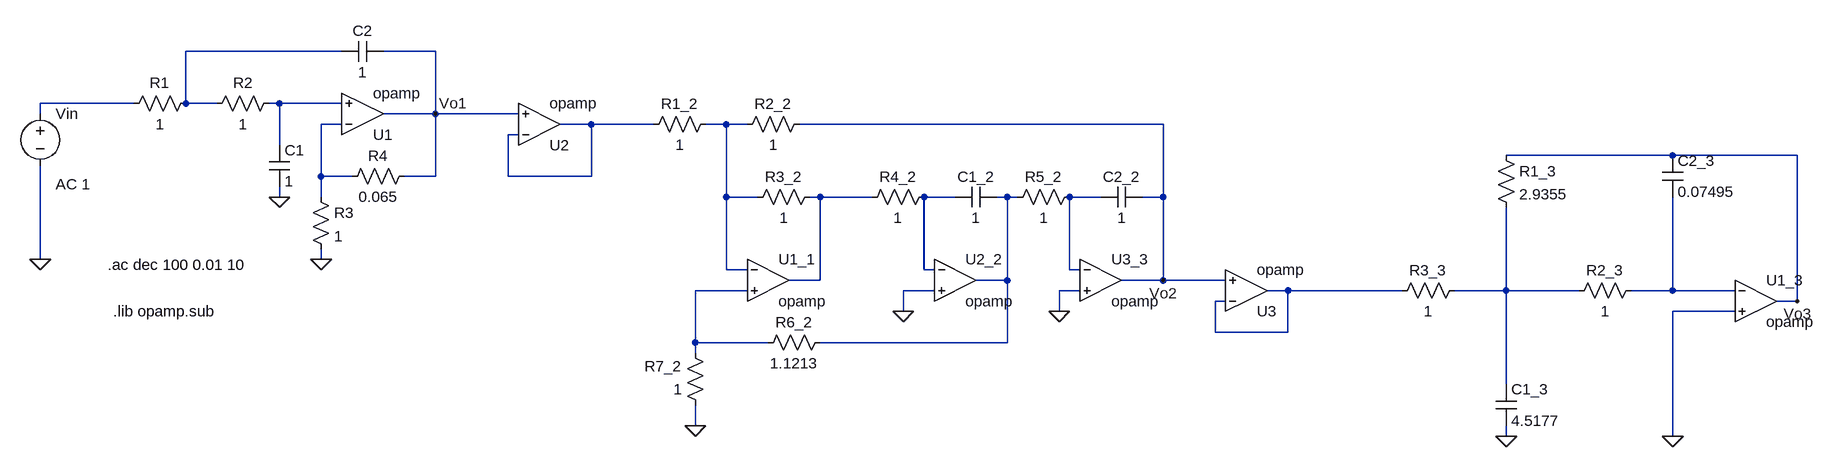
[diagram p0: schematic Tarea_2_Filtro_Completo.asc]
Tarea_2_Filtro_Completo.asc, the LTspice schematic file:
Version 4
SHEET 1 2680 680
WIRE 400 48 160 48
WIRE 544 48 464 48
WIRE 80 128 -64 128
WIRE 160 128 160 48
WIRE 208 128 160 128
WIRE 304 128 288 128
WIRE 400 128 304 128
WIRE -64 144 -64 128
WIRE 544 144 544 48
WIRE 544 144 464 144
WIRE 672 144 544 144
WIRE 400 160 368 160
WIRE 784 160 736 160
WIRE 880 160 784 160
WIRE 992 160 960 160
WIRE 1024 160 992 160
WIRE 1664 160 1104 160
WIRE 672 176 656 176
WIRE 304 192 304 128
WIRE 2448 208 2192 208
WIRE 2640 208 2448 208
WIRE 368 240 368 160
WIRE 416 240 368 240
WIRE 544 240 544 144
WIRE 544 240 496 240
WIRE 656 240 656 176
WIRE 784 240 784 160
WIRE 784 240 656 240
WIRE 304 272 304 256
WIRE 368 272 368 240
WIRE 992 272 992 160
WIRE 1040 272 992 272
WIRE 1136 272 1120 272
WIRE 1216 272 1136 272
WIRE 1344 272 1296 272
WIRE 1424 272 1408 272
WIRE 1440 272 1424 272
WIRE 1568 272 1520 272
WIRE 1664 272 1664 160
WIRE 1664 272 1632 272
WIRE -64 368 -64 224
WIRE 368 368 368 352
WIRE 992 384 992 272
WIRE 1024 384 992 384
WIRE 1296 384 1296 272
WIRE 1312 384 1296 384
WIRE 1520 384 1520 272
WIRE 1536 384 1520 384
WIRE 1136 400 1136 272
WIRE 1136 400 1088 400
WIRE 1424 400 1424 272
WIRE 1424 400 1376 400
WIRE 1664 400 1664 272
WIRE 1664 400 1600 400
WIRE 1760 400 1664 400
WIRE 1024 416 944 416
WIRE 1312 416 1264 416
WIRE 1536 416 1504 416
WIRE 1856 416 1824 416
WIRE 2032 416 1856 416
WIRE 2192 416 2192 288
WIRE 2192 416 2112 416
WIRE 2304 416 2192 416
WIRE 2448 416 2448 272
WIRE 2448 416 2384 416
WIRE 2544 416 2448 416
WIRE 1760 432 1744 432
WIRE 2640 432 2640 208
WIRE 2640 432 2608 432
WIRE 1264 448 1264 416
WIRE 1504 448 1504 416
WIRE 2544 448 2448 448
WIRE 1744 480 1744 432
WIRE 1856 480 1856 416
WIRE 1856 480 1744 480
WIRE 944 496 944 416
WIRE 1056 496 944 496
WIRE 1424 496 1424 400
WIRE 1424 496 1136 496
WIRE 944 512 944 496
WIRE 2192 560 2192 416
WIRE 944 624 944 592
WIRE 2192 640 2192 624
WIRE 2448 640 2448 448
FLAG -64 368 0
FLAG 368 368 0
FLAG 304 272 0
FLAG 544 144 Vo1
FLAG 944 624 0
FLAG 1264 448 0
FLAG 1504 448 0
FLAG 1664 400 Vo2
FLAG 2192 640 0
FLAG 2448 640 0
FLAG 2640 432 Vo3
SYMBOL res 176 112 R90
WINDOW 0 0 56 VBottom 2
WINDOW 3 32 56 VTop 2
SYMATTR InstName R1
SYMATTR Value 1
SYMBOL voltage -64 128 R0
WINDOW 123 24 124 Left 2
WINDOW 39 0 0 Left 0
SYMATTR Value2 AC 1
SYMATTR InstName Vin
SYMATTR Value ""
SYMBOL OpAmps\\opamp 432 208 M180
SYMATTR InstName U1
SYMBOL res 304 112 R90
WINDOW 0 0 56 VBottom 2
WINDOW 3 32 56 VTop 2
SYMATTR InstName R2
SYMATTR Value 1
SYMBOL cap 288 192 R0
SYMATTR InstName C1
SYMATTR Value 1
SYMBOL cap 464 32 R90
WINDOW 0 0 32 VBottom 2
WINDOW 3 32 32 VTop 2
SYMATTR InstName C2
SYMATTR Value 1
SYMBOL res 352 256 R0
SYMATTR InstName R3
SYMATTR Value 1
SYMBOL res 512 224 R90
WINDOW 0 0 56 VBottom 2
WINDOW 3 32 56 VTop 2
SYMATTR InstName R4
SYMATTR Value 0.065
SYMBOL OpAmps\\opamp 704 224 M180
SYMATTR InstName U2
SYMBOL res 976 144 R90
WINDOW 0 0 56 VBottom 2
WINDOW 3 32 56 VTop 2
SYMATTR InstName R1_2
SYMATTR Value 1
SYMBOL res 1120 144 R90
WINDOW 0 0 56 VBottom 2
WINDOW 3 32 56 VTop 2
SYMATTR InstName R2_2
SYMATTR Value 1
SYMBOL res 1136 256 R90
WINDOW 0 0 56 VBottom 2
WINDOW 3 32 56 VTop 2
SYMATTR InstName R3_2
SYMATTR Value 1
SYMBOL res 1312 256 R90
WINDOW 0 0 56 VBottom 2
WINDOW 3 32 56 VTop 2
SYMATTR InstName R4_2
SYMATTR Value 1
SYMBOL res 1536 256 R90
WINDOW 0 0 56 VBottom 2
WINDOW 3 32 56 VTop 2
SYMATTR InstName R5_2
SYMATTR Value 1
SYMBOL res 960 608 R180
WINDOW 0 36 76 Left 2
WINDOW 3 36 40 Left 2
SYMATTR InstName R7_2
SYMATTR Value 1
SYMBOL res 1040 512 R270
WINDOW 0 32 56 VTop 2
WINDOW 3 0 56 VBottom 2
SYMATTR InstName R6_2
SYMATTR Value 1.1213
SYMBOL cap 1408 256 R90
WINDOW 0 0 32 VBottom 2
WINDOW 3 32 32 VTop 2
SYMATTR InstName C1_2
SYMATTR Value 1
SYMBOL OpAmps\\opamp 1056 336 R0
SYMATTR InstName U1_1
SYMBOL OpAmps\\opamp 1344 336 R0
SYMATTR InstName U2_2
SYMBOL OpAmps\\opamp 1568 336 R0
SYMATTR InstName U3_3
SYMBOL cap 1632 256 R90
WINDOW 0 0 32 VBottom 2
WINDOW 3 32 32 VTop 2
SYMATTR InstName C2_2
SYMATTR Value 1
SYMBOL OpAmps\\opamp 1792 480 M180
SYMATTR InstName U3
SYMBOL res 2128 400 R90
WINDOW 0 0 56 VBottom 2
WINDOW 3 32 56 VTop 2
SYMATTR InstName R3_3
SYMATTR Value 1
SYMBOL res 2176 192 R0
SYMATTR InstName R1_3
SYMATTR Value 2.9355
SYMBOL res 2400 400 R90
WINDOW 0 0 56 VBottom 2
WINDOW 3 32 56 VTop 2
SYMATTR InstName R2_3
SYMATTR Value 1
SYMBOL cap 2432 208 R0
SYMATTR InstName C2_3
SYMATTR Value 0.07495
SYMBOL cap 2176 560 R0
SYMATTR InstName C1_3
SYMATTR Value 4.5177
SYMBOL OpAmps\\opamp 2576 368 R0
SYMATTR InstName U1_3
TEXT 40 376 Left 2 !.ac dec 100 0.01 10
TEXT 48 448 Left 2 !.lib opamp.sub

The netlist it stands for:
* Tarea_2_Filtro_Completo.asc
R1 N001 N002 1
Vin N002 0 AC 1
XU1 N004 N003 Vo1 opamp Aol=100K GBW=10Meg  ; pins invin noninvin out
R2 N003 N001 1
C1 N003 0 1
C2 Vo1 N001 1
R3 N004 0 1
R4 Vo1 N004 0.065
XU2 N005 Vo1 N005 opamp Aol=100K GBW=10Meg  ; pins invin noninvin out
R1_2 N006 N005 1
R2_2 Vo2 N006 1
R3_2 N007 N006 1
R4_2 N008 N007 1
R5_2 N010 N009 1
R7_2 0 N011 1
R6_2 N011 N009 1.1213
C1_2 N009 N008 1
XU1_1 N006 N011 N007 opamp Aol=100K GBW=10Meg  ; pins invin noninvin out
XU2_2 N008 0 N009 opamp Aol=100K GBW=10Meg  ; pins invin noninvin out
XU3_3 N010 0 Vo2 opamp Aol=100K GBW=10Meg  ; pins invin noninvin out
C2_2 Vo2 N010 1
XU3 N012 Vo2 N012 opamp Aol=100K GBW=10Meg  ; pins invin noninvin out
R3_3 N013 N012 1
R1_3 Vo3 N013 2.9355
R2_3 N014 N013 1
C2_3 Vo3 N014 0.07495
C1_3 N013 0 4.5177
XU1_3 N014 0 Vo3 opamp Aol=100K GBW=10Meg  ; pins invin noninvin out
.ac dec 100 0.01 10
.lib opamp.sub
.backanno
.end